# EAGLE design Lapse controller, Rev2 (EAGLE 7.2.0)
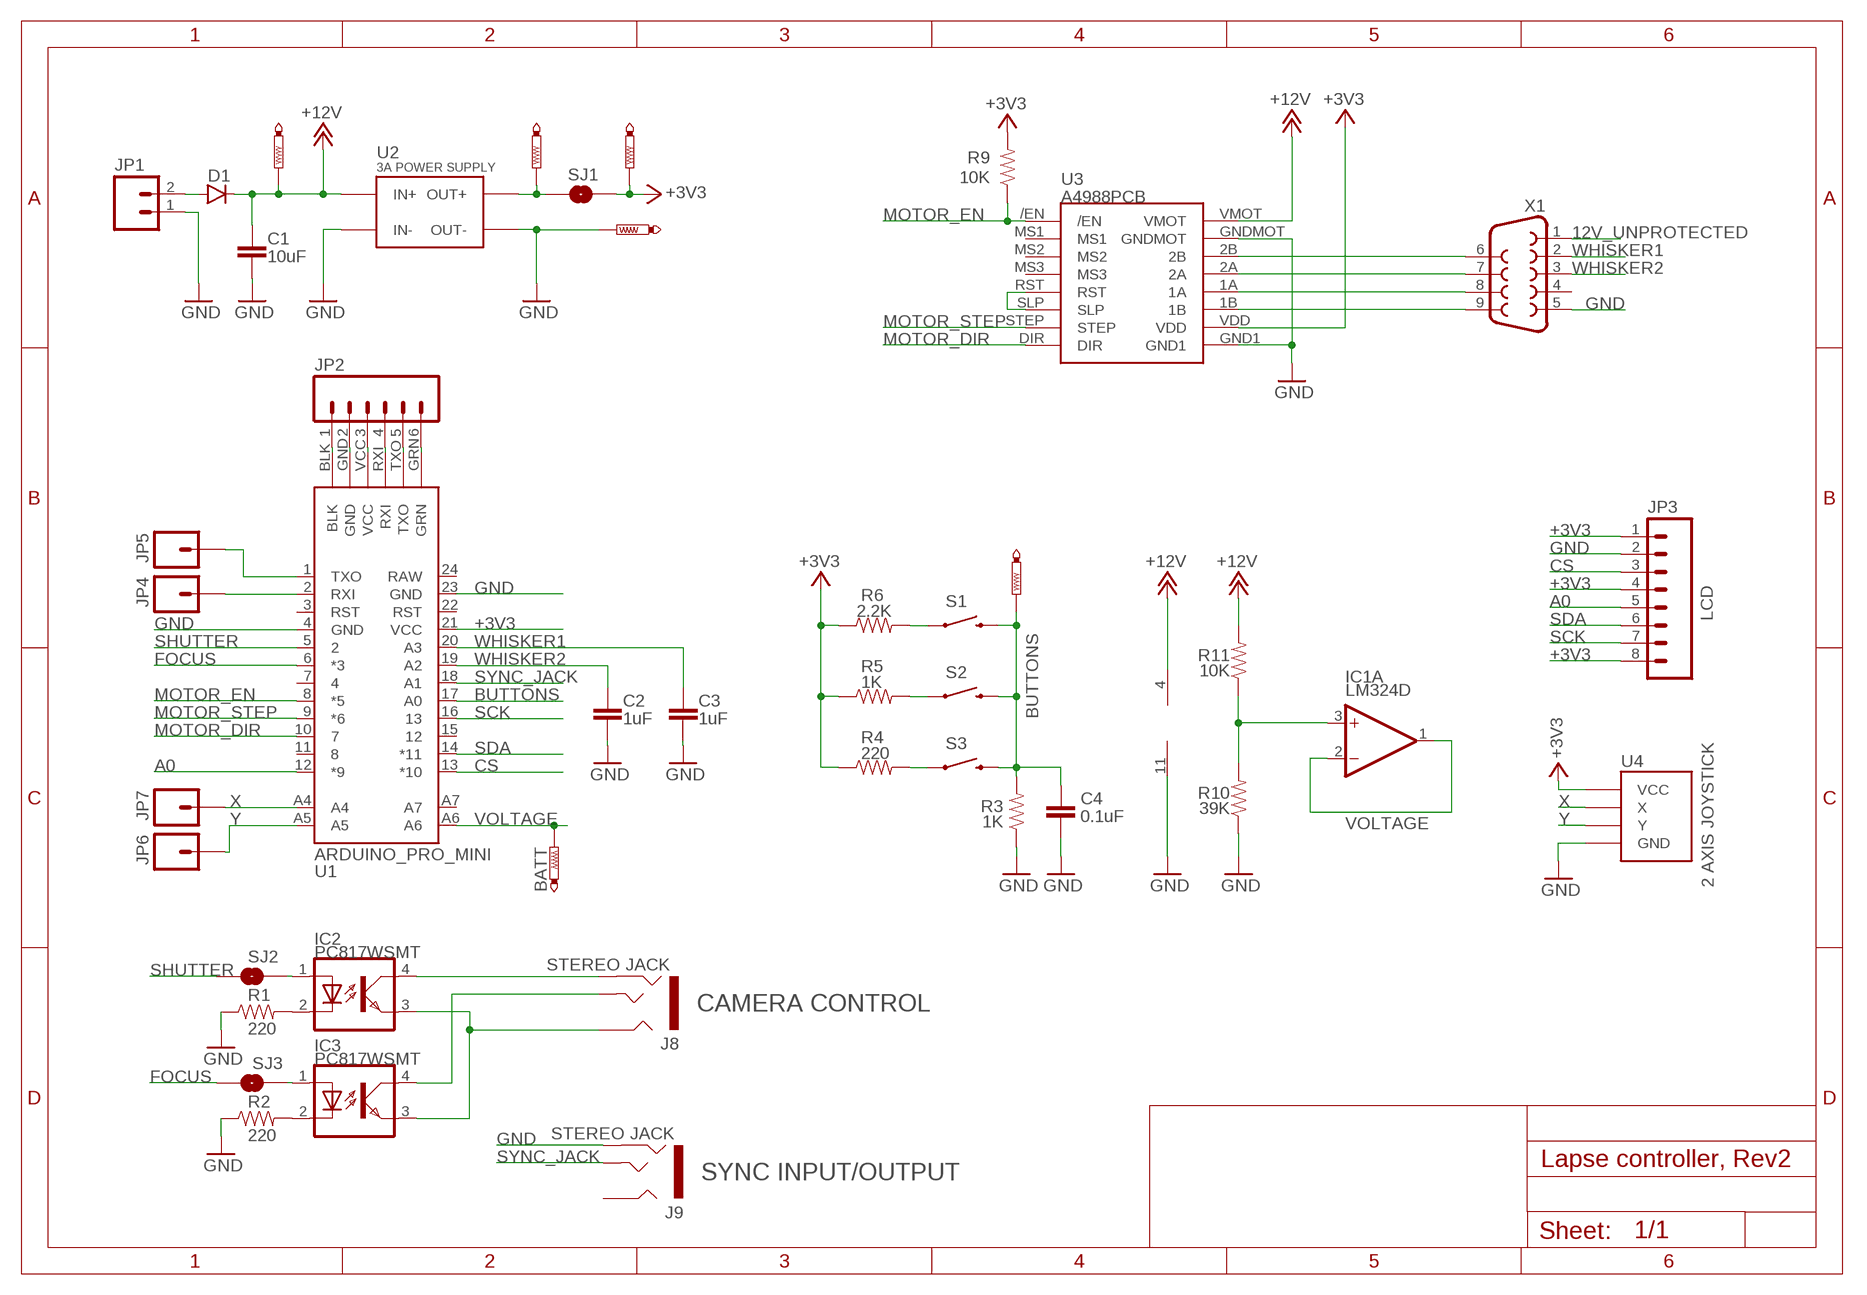
[diagram p0: schematic, sheet 1]

## Parts
3.3V  PTR1PAD1-13  [P1-13]
3.3V1  PTR1PAD1-13  [P1-13]
12V  PTR1PAD1-13  [P1-13]
BATT  PTR1PAD1-13  [P1-13]
BUTTON  PTR1PAD1-13  [P1-13]
C1  10uF  C-EUC0805K  [C0805K]
C2  1uF  C-EUC0805K  [C0805K]
C3  1uF  C-EUC0805K  [C0805K]
C4  0.1uF  C-EUC1206K  [C1206K]
D1  DIODESMA  [SMA-DIODE]
GND  PTR1PAD1-13  [P1-13]
IC1  LM324D  [SO14]
IC2  PC817WSMT  [WSMT]
IC3  PC817WSMT  [WSMT]
J8  STEREO JACK  AUDIO-JACK3  [AUDIO-JACK-TRRS-SMD]
J9  STEREO JACK  AUDIO-JACK3  [AUDIO-JACK-TRRS-SMD]
JP1  M02PTH3  [1X02_LONGPADS]
JP2  M06NO_SILK_FEMALE_PTH  [1X06_NO_SILK]
JP3  LCD  M08LONGPADS  [1X08_LONGPADS]
JP4  M01OFFSET  [1X01_OFFSET]
JP5  M01OFFSET  [1X01_OFFSET]
JP6  M01OFFSET  [1X01_OFFSET]
JP7  M01OFFSET  [1X01_OFFSET]
R1  220  RESISTOR1206  [1206]
R2  220  RESISTOR1206  [1206]
R3  1K  RESISTOR1206  [1206]
R4  220  RESISTOR1206  [1206]
R5  1K  RESISTOR1206  [1206]
R6  2.2K  RESISTOR1206  [1206]
R9  10K  RESISTOR1206  [1206]
R10  39K  RESISTOR1206  [1206]
R11  10K  RESISTOR1206  [1206]
S1  SWITCH-MOMENTARY-212MM  [TACTILE-PTH-12MM]
S2  SWITCH-MOMENTARY-212MM  [TACTILE-PTH-12MM]
S3  SWITCH-MOMENTARY-212MM  [TACTILE-PTH-12MM]
SJ1  JUMPER-PAD-2-NOROUND  [PAD-JUMPER-2-NO_YES_SILK_ROUND]
SJ2  JUMPER-PAD-2-NO  [PAD-JUMPER-2-NO_NO_SILK]
SJ3  JUMPER-PAD-2-NO  [PAD-JUMPER-2-NO_NO_SILK]
U1  ARDUINO_PRO_MINI  [ARDUINO_PRO_MINI]
U2  3A POWER SUPPLY  3A_DC_DC_SUPERMINI_PWR_SUPPLY  [3A_DC_DC_SUPERMINI_PWR_SUPPLY]
U3  A4988PCB  [A4988PCB]
U4  2 AXIS JOYSTICK  2WAY_JOYSTICK  [2WAY_JOYSTICK]
X1  CONN  F09D  [F09D]

## Nets
12V_UNPROTECTED: D1.A JP1.2 X1.1
+3V3: 3.3V.TP JP3.1 JP3.4 JP3.8 R4.1 R5.1 R6.1 R9.2 SJ1.2 U1.21(VCC) U3.VDD U4.P$1(VCC) U4.P$4(VCC)
+12V: 12V.TP C1.1 D1.C IC1.4(P:V+) R11.2 U2.IN+ U3.VMOT
A0: JP3.5 U1.12(*9)
BUTTONS: BUTTON.TP C4.1 R3.2 S1.3 S2.3 S3.3 U1.17(A0)
CS: JP3.3 U1.13(*10)
FOCUS: SJ3.1 U1.6(*3)
FOCUS_A: IC3.1(A) SJ3.2
GND: C1.2 C2.2 C3.2 C4.2 GND.TP IC1.11(P:V-) J9.RING2A(RING2) J9.RING2B(RING2) JP1.1 JP3.2 R1.1 R2.1 R3.1 R10.1 U1.4(GND) U1.23(GND) U2.IN- U2.OUT- U3.GND1 U3.GNDMOT U4.P$3(GND) U4.P$6(GND) X1.5
MOTOR_DIR: U1.10 U3.DIR
MOTOR_EN: R9.1 U1.8(*5) U3./EN
MOTOR_STEP: U1.9(*6) U3.STEP
N$1: 3.3V1.TP SJ1.1 U2.OUT+
N$2: IC2.2(C) R1.2
N$3: IC3.2(C) R2.2
N$4: IC2.4(COL) J8.RING2A(RING2) J8.RING2B(RING2)
N$5: IC2.3(EMIT) IC3.3(EMIT) J8.RING1A(RING1) J8.RING1B(RING1)
N$6: IC3.4(COL) J8.EARTH1(TIP) J8.EARTH2(TIP)
N$7: R4.2 S3.1
N$8: R5.2 S2.1
N$9: R6.2 S1.1
N$10: U3.RST U3.SLP
N$11: U3.2B X1.6
N$12: U3.2A X1.7
N$13: U3.1A X1.8
N$14: U3.1B X1.9
N$15: JP2.1 U1.BLK
N$16: IC1.3(A:+IN) R10.2 R11.1
N$17: JP2.2 U1.GND
N$18: JP2.3 U1.VCC
N$19: JP2.4 U1.RXI
N$20: JP2.5 U1.TXO
N$21: JP2.6 U1.GRN
N$22: JP4.1 U1.2(RXI)
N$23: JP5.1 U1.1(TXO)
SCK: JP3.7 U1.16
SDA: JP3.6 U1.14(*11)
SHUTTER: SJ2.1 U1.5
SHUTTER_A: IC2.1(A) SJ2.2
SYNC_JACK: J9.EARTH1(TIP) J9.EARTH2(TIP) U1.18(A1)
VOLTAGE: BATT.TP IC1.1(A:OUT) IC1.2(A:-IN) U1.A6
WHISKER1: C3.1 U1.20(A3) X1.2
WHISKER2: C2.1 U1.19(A2) X1.3
X: JP7.1 U1.A4 U4.P$2(X)
Y: JP6.1 U1.A5 U4.P$5(Y)
Unconnected: IC1.5(B:+IN) IC1.6(B:-IN) IC1.7(B:OUT) IC1.8(C:OUT) IC1.9(C:-IN) IC1.10(C:+IN) IC1.12(D:+IN) IC1.13(D:-IN) IC1.14(D:OUT) J9.RING1A(RING1) J9.RING1B(RING1) U1.3(RST) U1.7 U1.11 U1.15 U1.22(RST) U1.24(RAW) U1.A7 U3.MS1 U3.MS2 U3.MS3 X1.4

## Notes on the sheet
- CAMERA CONTROL
- SYNC INPUT/OUTPUT

## Library data of the parts
3.3V 3.3V1 12V BATT BUTTON GND = testpad:PTR1: TEST PIN
C1-C4 = rcl:C-EU: CAPACITOR, European symbol
D1 = SparkFun-DiscreteSemi:DIODE: Diode These are standard reverse protection diodes and small signal diodes. SMA package can handle up to about 1A. SOD-323 can handle about 200mA. What the SOD-323 package when ordering, there are some mfgs out there that are 5-pin packages.
IC1 = linear:LM324: OP AMP
IC2 IC3 = bymacf:PC817: SHARP OPTO COUPLER
J8 J9 = bymacf:AUDIO-JACK3: Audio jack - 3.5mm three rings SMD
JP1 = SparkFun-Connectors:M02: Standard 2-pin 0.1" header. Use with - straight break away headers ( PRT-00116) - right angle break away headers (PRT-00553) - swiss pins (PRT-00743) - machine pins (PRT-00117) - female headers (PRT-00115) Molex polarized connector foot print use with: PRT-08233 with associated crimp pins and housings. 2.54_SCREWTERM for use with PRT-10571. 3.5mm Screw Terminal footprints for PRT-08084 5mm Screw Terminal footprints for use with PRT-08432
JP2 = SparkFun-Connectors:M06: Header 6 Standard 6-pin 0.1" header. Use with straight break away headers (SKU : PRT-00116), right angle break away headers (PRT-00553), swiss pins (PRT-00743), machine pins (PRT-00117), and female headers (PRT-00115). Molex polarized connector foot print use with SKU : PRT-08094 with associated crimp pins and housings. NOTES ON THE VARIANTS LOCK and LOCK_LONGPADS... This footprint was designed to help hold the alignment of a through-hole component (i.e. 6-pin header) while soldering it into place. You may notice that each hole has been shifted either up or down by 0.005 of an inch from it's more standard position (which is a perfectly straight line). This slight alteration caused the pins (the squares in the middle) to touch the edges of the holes. Because they are alternating, it causes a "brace" to hold the component in place. 0.005 has proven to be the perfect amount of "off-center" position when using our standard breakaway headers. Although looks a little odd when you look at the bare footprint, once you have a header in there, the alteration is very hard to notice. Also,if you push a header all the way into place, it is covered up entirely on the bottom side. This idea of altering the position of holes to aid alignment will be further integrated into the Sparkfun Library for other footprints. It can help hold any component with 3 or more connection pins.; PROD_ID: CONN-08437
JP3 = SparkFun-Connectors:M08: Header 8 Standard 8-pin 0.1" header. Use with straight break away headers (SKU : PRT-00116), right angle break away headers (PRT-00553), swiss pins (PRT-00743), machine pins (PRT-00117), and female headers (PRT-00115).
JP4-JP7 = SparkFun-Connectors:M01: Header 1 Standard 1-pin 0.1" header. Use with straight break away headers (SKU : PRT-00116), right angle break away headers (PRT-00553), swiss pins (PRT-00743), machine pins (PRT-00117), and female headers (PRT-00115).
R1-R6 R9-R11 = SparkFun-Passives:RESISTOR: Resistor Basic schematic elements and footprints for 0603, 1206, and PTH resistors.
S1-S3 = SparkFun-Electromechanical:SWITCH-MOMENTARY-2: Various NO switches- pushbuttons, reed, etc; PROD_ID: SWCH-09185
SJ1-SJ3 = SparkFun-Passives:JUMPER-PAD-2-NO
U1 = bymacf:ARDUINO_PRO_MINI
U2 = bymacf:3A_DC_DC_SUPERMINI_PWR_SUPPLY: 100% brand new and high quality. Module Properties: Non-isolated step-down module (BUCK) Rectification: Synchronous rectification Input voltage: DC 4.75V-23V Output voltage: DC 1.0V-17V (Adjustable, Output < Input) Output current: Rated current 1.8A (3A MAX, can not be prolonged) Conversion efficiency:96%(highest) Switching Frequency: 340KHz. Output ripple:30mV(no-load) Load regulation:±0.5% Voltage regulation:±2.5% Operating Temperature: Industrial (-40℃ ~ +85℃) Short circuit protection: No(Please do not short-circuit) Input Reverse protection: No(Can not be reversed) Dimension: approx.17mm*11mm*3.8mm(L*W*H)/17*11*3.8 Supper mini board
U3 = bymacf:A4988PCB: A4988 PCB, Motor driver The A4988 is a complete microstepping motor driver with built-in translator for easy operation. It is designed to operate bipolar stepper motors in full-, half-, quarter-, eighth-, and sixteenth-step modes, with an output drive capacity of up to 35 V and ±2 A. The A4988 includes a fixed off-time current regulator which has the ability to operate in Slow or Mixed decay modes.
U4 = bymacf:2WAY_JOYSTICK
X1 = con-subd:F09: SUB-D; OC_FARNELL: unknown; OC_NEWARK: unknown

## Board
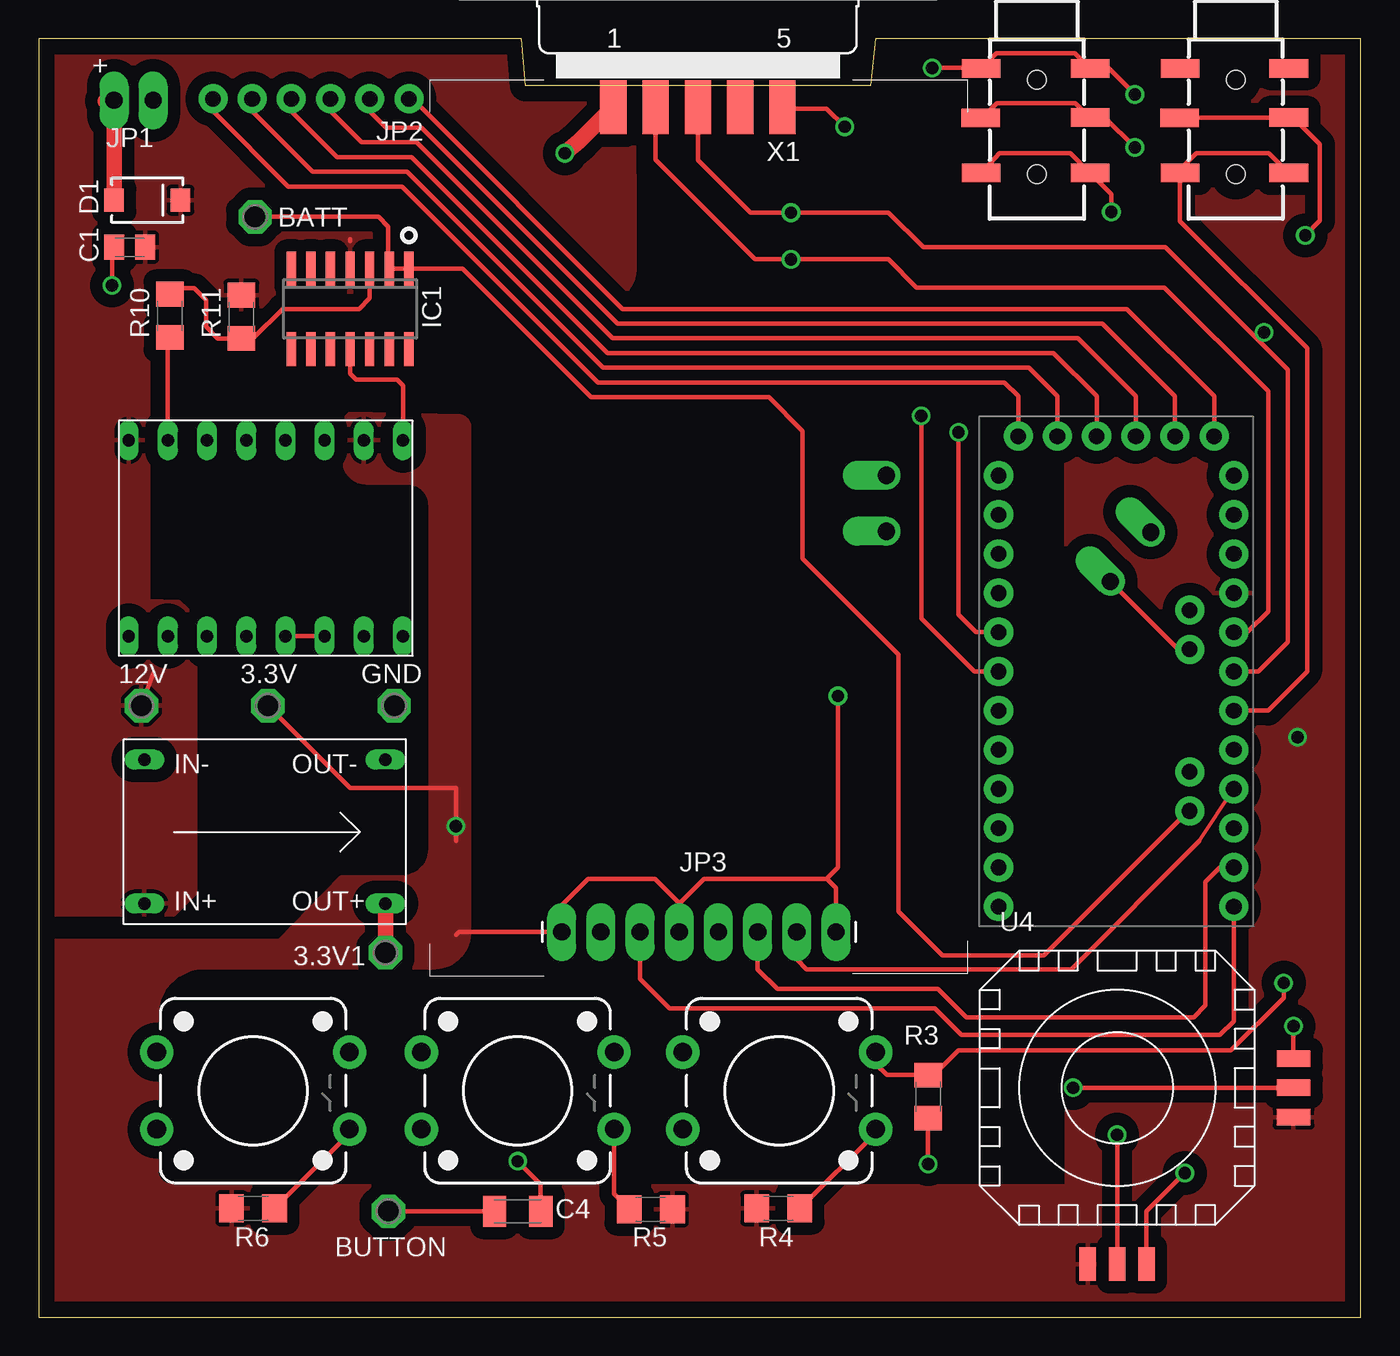
[diagram p1: board, top side]
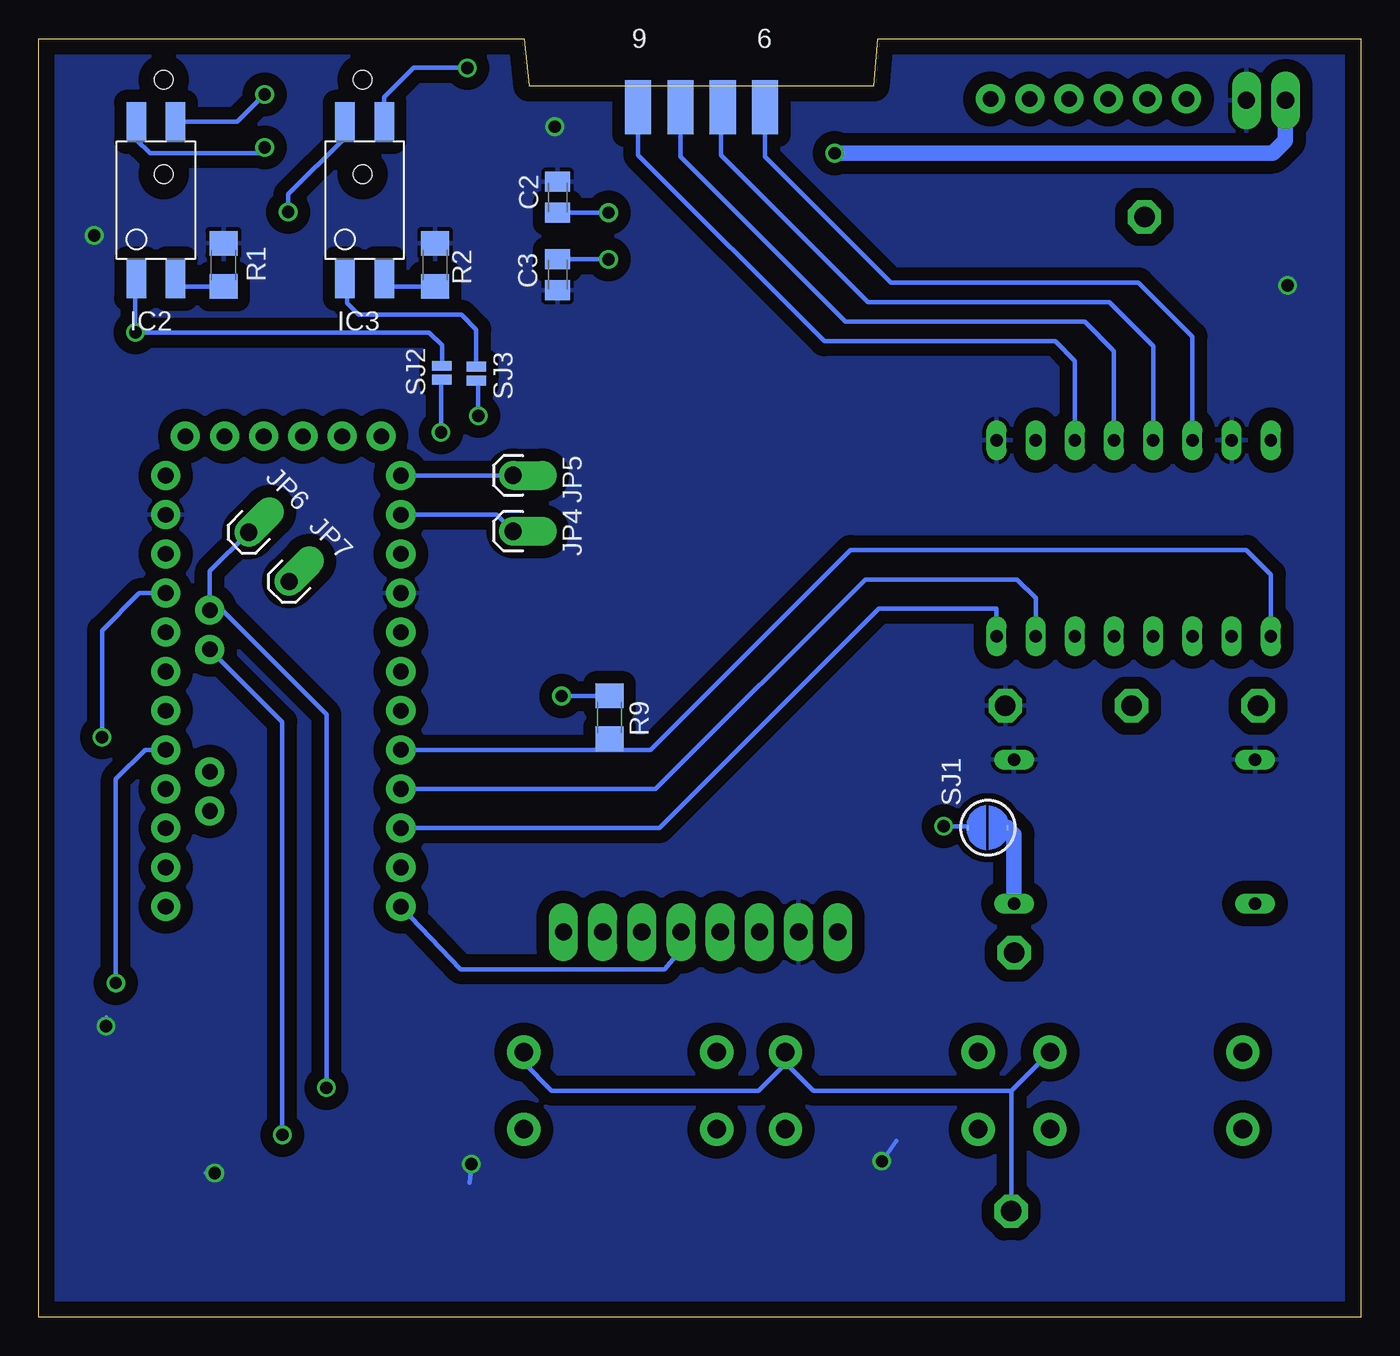
[diagram p2: board, bottom side, seen from below]

Size 85.71 x 82.87 mm. Coordinates in mm from the lower left corner, seen from the top.
Outline: 0,0 85.71,0 85.71,82.86 54.23,82.87 53.91,79.82 31.56,79.82 31.31,82.86 0,82.86 0,0
Copper layers (1*16): Top 0.035mm / dielectric 1.5mm / Bottom 0.035mm
Design rules "default": minimum track width 10mil, minimum drill 24mil, track to track 8mil, track to pad 8mil, pad to pad 8mil, via to via 8mil, smd to smd 8mil, copper to edge 40mil, drill to drill 8mil, minimum pad ring 10mil, minimum via ring 8mil, stop-mask expansion 4mil, vias tented up to drill 0mil, thermal gap 10mil

### Footprints (pad centres in the part's own frame; a part is rotated, then mirrored left to right if it is on the bottom)
P1-13 = drill 1.321 pad 2.159 octagon: TP 0,0
C0805K = smd 1.3 x 1.6: 1 -1,0; 2 1,0
C1206K = smd 1.5 x 2: 1 -1.5,0; 2 1.5,0
SMA-DIODE = smd 1.27 x 1.47: A -2.15,0; C 2.15,0
SO14 = smd 0.6 x 2.2: 1 -3.81,-2.6; 2 -2.54,-2.6; 3 -1.27,-2.6; 4 0,-2.6; 5 1.27,-2.6; 6 2.54,-2.6; 7 3.81,-2.6; 8 3.81,2.6; 9 2.54,2.6; 10 1.27,2.6; 11 0,2.6; 12 -1.27,2.6; 13 -2.54,2.6; 14 -3.81,2.6
WSMT = smd 2.54 x 1.27: 1 -5.08,1.27; 2 -5.08,-1.27; 3 5.08,-1.27; 4 5.08,1.27
AUDIO-JACK-TRRS-SMD = smd 1.2 x 2.5: EARTH1 9.995,3.441; EARTH2 9.995,-3.608; RING1A 3.2,3.441; RING1B 3.2,-3.608; RING2A 6.391,3.441; RING2B 6.41,-3.631 | hole 1.2: 3.95,0; 10.06,0
1X02_LONGPADS = drill 1.118 pad 1.88 long: 1 0,0; 2 2.54,0
1X06_NO_SILK = drill 1.016 pad 1.88: 1 0,0; 2 2.54,0; 3 5.08,0; 4 7.62,0; 5 10.16,0; 6 12.7,0
1X08_LONGPADS = drill 1.118 pad 1.88 long: 1 0,0; 2 2.54,0; 3 5.08,0; 4 7.62,0; 5 10.16,0; 6 12.7,0; 7 15.24,0; 8 17.78,0
1X01_OFFSET = drill 1.118 pad 1.88 offset: 1 0,0
1206 = smd 1.6 x 1.8: 1 -1.4,0; 2 1.4,0
TACTILE-PTH-12MM = drill 1.2 pad 2.159: 1 6.25,-2.5; 2 -6.25,-2.5; 3 6.25,2.5; 4 -6.25,2.5
PAD-JUMPER-2-NO_YES_SILK_ROUND = smd 0.152 x 0.305: 1 -1.27,0; 2 1.27,0
PAD-JUMPER-2-NO_NO_SILK = smd 0.635 x 1.27: 1 -0.45,0; 2 0.45,0
ARDUINO_PRO_MINI = drill 1.016 pad 1.88: 1 -7.62,12.7; 2 -7.62,10.16; 3 -7.62,7.62; 4 -7.62,5.08; 5 -7.62,2.54; 6 -7.62,0; 7 -7.62,-2.54; 8 -7.62,-5.08; 9 -7.62,-7.62; 10 -7.62,-10.16; 11 -7.62,-12.7; 12 -7.62,-15.24; 13 7.62,-15.24; 14 7.62,-12.7; 15 7.62,-10.16; 16 7.62,-7.62; 17 7.62,-5.08; 18 7.62,-2.54; 19 7.62,0; 20 7.62,2.54; 21 7.62,5.08; 22 7.62,7.62; 23 7.62,10.16; 24 7.62,12.7; A4 4.763,1.429; A5 4.763,3.969; A6 4.763,-9.049; A7 4.763,-6.509; BLK -6.35,15.24; GND -3.81,15.24; GRN 6.35,15.24; RXI 1.27,15.24; TXO 3.81,15.24; VCC -1.27,15.24
3A_DC_DC_SUPERMINI_PWR_SUPPLY = drill 0.8 long: IN+ -7.62,-4.636; IN- -7.62,4.699; OUT+ 8.001,-4.636; OUT- 8.001,4.699
A4988PCB = drill 0.8 long: 1A 6.35,-1.27; 1B 6.35,-3.81; 2A 6.35,1.27; 2B 6.35,3.81; /EN -6.35,8.89; DIR -6.35,-8.89; GND1 6.35,-8.89; GNDMOT 6.35,6.35; MS1 -6.35,6.35; MS2 -6.35,3.81; MS3 -6.35,1.27; RST -6.35,-1.27; SLP -6.35,-3.81; STEP -6.35,-6.35; VDD 6.35,-6.35; VMOT 6.35,8.89
2WAY_JOYSTICK = smd 1.067 x 2.184: P$1 -1.905,-11.43; P$2 0,-11.43; P$3 1.905,-11.43 | smd 2.184 x 1.067: P$4 11.43,-1.905; P$5 11.43,0; P$6 11.43,1.905
F09D = smd 1.7 x 3.5: 1 -5.486,-6.045; 2 -2.743,-6.045; 3 0,-6.045; 4 2.743,-6.045; 5 5.486,-6.045 | smd 1.7 x 3.5 bottom: 6 -4.115,-6.045; 7 -1.372,-6.045; 8 1.372,-6.045; 9 4.115,-6.045

### Placement (x,y rotation side)
3.3V  14.86,39.62 270 top
3.3V1  22.48,23.62 0 top
12V  6.67,39.62 270 top
BATT  14.03,71.31 0 top
BUTTON  22.67,6.86 0 top
C1  5.91,69.34 180 top
C2  52.07,72.58 90 bottom
C3  52.07,67.56 270 bottom
C4  31.05,6.86 0 top
D1  7.05,72.39 0 top
GND  23.05,39.62 270 top
IC1  20.19,65.34 180 top
IC2  78.11,72.39 90 bottom
IC3  64.58,72.39 90 bottom
J8  64.71,84.14 270 top
J9  77.6,84.14 270 top
JP1  7.43,78.87 180 top
JP2  11.3,78.95 0 top
JP3  33.91,24.96 0 top
JP4  54.96,50.94 270 bottom
JP5  54.95,54.56 270 bottom
JP6  72.09,50.86 315 bottom
JP7  69.48,47.68 315 bottom
R1  73.72,68.2 270 bottom
R2  60.01,68.2 270 bottom
R3  57.66,14.29 90 top
R4  47.94,7.05 0 top
R5  39.69,6.98 180 top
R6  13.91,7.05 0 top
R9  48.7,38.86 90 bottom
R10  8.51,64.9 90 top
R11  13.14,64.83 90 top
S1  13.91,14.67 0 top
S2  31.05,14.67 0 top
S3  48.01,14.67 0 top
SJ1  24.19,31.72 180 bottom
SJ2  59.57,61.21 90 bottom
SJ3  57.34,61.15 90 bottom
U1  69.85,41.85 0 top
U2  14.48,31.43 0 top
U3  14.73,50.48 90 top
U4  69.91,14.86 0 top
X1  42.74,84.45 0 top

### Tracks (layer width: path | path; a pad name or v marks a point on that pad's centre or on a via)
12V_UNPROTECTED  (via drill 0.8)
  Top 1.016: v34.1,75.44 35.04,76.2 X1.1 | 4.33,78.81 JP1.2 4.89,72.57 D1.A
  Bottom 1.016: v34.1,75.44 5.71,75.44 4.89,76.26 JP1.2
+3V3  (via drill 0.8)
  Top 0.305: JP3.8 51.69,27.81 51.12,28.38 51.06,28.38 | 41.53,26.8 39.94,28.38 35.62,28.38 33.91,26.67 JP3.1 27.24,24.95 27.05,24.76 | JP3.4 41.53,26.8 | 41.53,26.8 43.12,28.38 51.06,28.38 | v51.82,40.26 51.82,29.15 51.06,28.38 | 27.05,30.86 v27.05,31.81 27.05,34.29 20.19,34.29 3.3V.TP
  Bottom 0.305: v81.6,37.59 81.6,44.51 79.19,46.93 U1.21 | v51.82,40.26 49.85,40.26 R9.2 | SJ1.2 25.56,31.81 v27.05,31.81
  pour Top (isolate 0.813): 20.19,58.55 19.81,58.17 19.81,55.53 arc90 21.24,54.1 23.91,54.1 arc-90 25.4,52.61 25.4,30.45 arc-90 23.62,28.48 19.62,28.48 15.62,24.38 0.19,24.38 0.2,24.29 0.15,-0.04 85.56,-0.04 85.56,82.71 66.61,82.71 66.64,8.51 8.67,8.48 arc-90 7.62,9.53 7.62,19.53 arc-90 10.76,22.67 25.72,22.67 arc90 27.91,25.05 27.91,57.53 arc90 27.24,58.39
+12V
  Top 0.305: 20.19,69.72 20.19,69.85 | 13.22,66.69 R11.2 | 12V.TP 7.43,41.72
  pour Top (isolate 0.813): 0.06,82.61 0.01,26.1 8.76,26.1 10.16,27.5 10.16,45.34 9.08,46.36 7.11,46.42 7.11,65.34 35.34,65.34 arc90 38.64,67.88 38.64,71.47 38.57,81.98 38.61,82.71
A0
  Bottom 0.305: JP3.5 44.07,23.81 45.15,22.54 58.36,22.54 U1.12
BUTTONS  (via drill 0.8)
  Top 0.305: S3.3 54.26,16.42 54.29,16.38 54.98,15.69 R3.2 58.04,15.68 59.63,17.27 77.28,17.27 80.71,20.7 v80.71,21.65 | C4.1 BUTTON.TP
  Bottom 0.305: 22.66,14.67 35.5,14.67 37.3,16.47 S2.3 37.3,16.42 39.05,14.67 52.45,14.67 54.26,16.47 S3.3 | v80.71,21.65 80.71,34.86 78.8,36.77 U1.17 | 22.66,14.67 S1.3 | 22.66,14.67 BUTTON.TP
CS
  Top 0.305: JP3.3 38.99,21.91 40.89,20 58.1,20 59.82,18.29 76.58,18.29 77.47,19.18 U1.13
FOCUS  (via drill 0.8)
  Top 0.305: v57.21,58.42 57.21,45.27 60.64,41.85 U1.6
  Bottom 0.305: v57.21,58.42 57.21,60.7 SJ3.1
FOCUS_A
  Bottom 0.305: SJ3.2 57.34,64.01 58.29,64.96 64.96,64.96 65.72,65.72 65.72,67.18 IC3.1
GND  (via drill 0.8)
  Top 0.305: J9.RING2A 80.7,77.73 J9.RING2B 79.06,77.72 81.34,77.72 83.06,76.01 83.06,71.06 v82.11,70.1 | v52.26,77.15 51.08,78.33 48.22,78.33 X1.5 | IC1.11 20.19,61.15 20.57,60.77 23.24,60.77 23.62,60.39 U3.GND1 | U3.GNDMOT 8.38,63.88 R10.1 | C1.2 4.76,69.15 v4.76,66.87 | R3.1 v57.66,9.91 | v74.3,9.33 71.82,6.86 U4.P$3 | U4.P$6 v81.34,18.86 | C4.2 32.55,8.6 v31.05,10.1
  Bottom 0.305: v57.66,9.91 57.78,8.7 | v31.05,10.1 30.1,11.43 | v74.3,9.33 74.87,9.33 | v81.34,18.86 81.34,19.43
  pour Bottom (isolate 0.813): 0.15,82.7 85.56,82.7 85.56,-0.04 0.15,0.15
MOTOR_DIR
  Bottom 0.305: U3.DIR 23.62,45.91 31.24,45.91 45.47,31.69 U1.10
MOTOR_EN
  Bottom 0.305: 48.51,36.77 U1.8 | U3./EN 5.84,48.13 7.43,49.72 33.08,49.72 46.04,36.77 48.51,36.77 | 48.51,36.77 R9.1
MOTOR_STEP
  Bottom 0.305: U1.9 45.72,34.23 32.13,47.82 22.29,47.82 21.08,46.61 U3.STEP
N$1
  Top 1.016: 3.3V1.TP U2.OUT+
  Bottom 1.016: U2.OUT+ 22.48,31.27 SJ1.1
N$2
  Bottom 0.305: IC2.2 76.32,66.8 R1.2
N$3
  Bottom 0.305: R2.2 62.8,66.8 IC3.2
N$4  (via drill 0.8)
  Top 0.305: J8.RING2B 61.15,77.73 62.1,78.68 67.22,78.68 J8.RING2A 69.13,77.75 v71.06,75.82
  Bottom 0.305: v71.06,75.82 71.44,75.44 78.49,75.44 79.38,76.33 IC2.4
N$5  (via drill 0.8)
  Top 0.305: v57.91,80.96 61.71,80.96 J8.RING1B 62.08,81.92 67.17,81.92 J8.RING1A 69.37,80.94 v71.06,79.25
  Bottom 0.305: v57.91,80.96 61.4,80.96 63.31,79.06 IC3.3 | v71.06,79.25 72.83,77.47 IC2.3
N$6  (via drill 0.8)
  Top 0.305: 60.26,73.98 61.57,73.98 J8.EARTH2 62.29,75.44 66.86,75.44 68.15,74.16 J8.EARTH1 68.19,74.14 68.2,74.16 | v69.53,71.63 69.53,72.77 69.1,73.2 68.2,74.16 | 68.2,74.16 67.58,74.16
  Bottom 0.305: IC3.4 65.85,76.45 69.53,72.77 v69.53,71.63
N$7
  Top 0.305: S3.1 54.26,11.9 R4.2
N$8
  Top 0.305: S2.1 37.3,7.97 R5.2
N$9
  Top 0.305: S1.1 20.16,11.9 R6.2
N$10
  Top 0.305: U3.SLP U3.RST
N$11
  Bottom 0.305: X1.6 38.62,75.2 30.48,67.06 14.41,67.06 10.92,63.56 U3.2B
N$12
  Bottom 0.305: X1.7 41.46,78.18 41.46,75.31 31.94,65.79 16.32,65.79 13.46,62.93 U3.2A
N$13
  Bottom 0.305: X1.8 44.11,75.22 33.4,64.52 17.91,64.52 16,62.61 U3.1A
N$14
  Bottom 0.305: X1.9 46.85,75.31 34.78,63.25 19.81,63.25 18.54,61.98 U3.1B
N$15
  Top 0.305: U1.BLK arc-90 U1.BLK 63.5,59.69 62.61,60.58 36.26,60.58 23.56,73.28 16.19,73.28 11.3,78.17 JP2.1
N$16
  Top 0.305: R10.2 8.51,66.67 10.1,66.67 10.86,65.91 10.86,64.2 11.62,63.43 R11.1 13.52,63.44 13.91,63.44 15.81,65.34 20.76,65.34 21.46,66.04 IC1.3
N$17
  Top 0.305: U1.GND arc-90 U1.GND 66.04,59.69 64.2,61.53 36.58,61.53 23.88,74.23 17.78,74.23 13.84,78.17 JP2.2
N$18
  Top 0.305: U1.VCC arc-90 U1.VCC 68.58,59.69 65.79,62.48 36.89,62.48 24.19,75.18 19.37,75.18 16.38,78.17 JP2.3
N$19
  Top 0.305: U1.RXI arc-90 U1.RXI 71.12,59.69 67.37,63.44 37.21,63.44 24.51,76.14 20.95,76.14 18.92,78.17 JP2.4
N$20
  Top 0.305: U1.TXO arc-90 U1.TXO 73.66,59.69 68.96,64.39 37.53,64.39 24.83,77.09 22.54,77.09 21.46,78.17 JP2.5
N$21
  Top 0.305: U1.GRN arc-90 U1.GRN 76.2,59.69 70.55,65.34 37.85,65.34 24.23,78.95 JP2.6
N$22
  Bottom 0.305: U1.2 56.02,52.01 JP4.1
N$23
  Bottom 0.305: U1.1 54.96,54.55 JP5.1
SCK
  Top 0.254: 75.25,30.86 U1.16
  Top 0.305: JP3.7 49.15,23.18 49.78,22.54 66.93,22.54 75.25,30.86
SDA
  Top 0.305: JP3.6 46.61,22.54 47.88,21.27 58.29,21.27 60.13,19.43 74.87,19.43 75.63,20.19 75.63,28.19 76.58,29.15 U1.14
SHUTTER  (via drill 0.8)
  Top 0.305: v59.63,57.34 59.63,45.53 60.77,44.39 U1.5
  Bottom 0.305: v59.63,57.34 59.63,60.76 SJ2.1
SHUTTER_A  (via drill 0.8)
  Bottom 0.305: IC2.1 79.44,67.25 v79.44,63.82 60.39,63.82 59.57,63 SJ2.2
SYNC_JACK
  Top 0.305: U1.18 79.69,39.31 82.23,41.85 82.23,62.8 73.99,71.05 J9.EARTH2 73.99,74.37 75.06,75.44 79.74,75.44 J9.EARTH1
VOLTAGE
  Top 0.305: IC1.1 IC1.2 22.67,68 22.67,70.67 22.03,71.31 BATT.TP | IC1.1 | IC1.1 27.5,67.94 35.81,59.63 47.34,59.63 49.53,57.44 49.53,49.15 55.72,42.96 55.72,26.29 58.58,23.43 65.15,23.43 74.52,32.8 U1.A6
WHISKER1  (via drill 0.8)
  Top 0.305: U1.20 78.36,44.39 79.69,45.72 79.69,60.01 72.96,66.74 56.9,66.74 55.07,68.56 v48.77,68.56 46.44,68.56 39.99,75.01 X1.2
  Bottom 0.305: C3.1 v48.77,68.56
WHISKER2  (via drill 0.8)
  Top 0.305: U1.19 79.06,41.85 80.96,43.75 80.96,61.4 73.03,69.34 57.34,69.34 55.1,71.58 v48.77,71.58 46.15,71.58 42.74,74.99 X1.3
  Bottom 0.305: C2.1 v48.77,71.58
X  (via drill 0.8)
  Top 0.305: U4.P$2 v69.91,11.81 | JP7.1 73.88,43.27 U1.A4
  Bottom 0.305: v69.91,11.81 69.91,38.58 U1.A4
Y  (via drill 0.8)
  Top 0.305: U4.P$5 v67.06,14.86
  Bottom 0.305: JP6.1 74.61,48.34 U1.A5 73.82,45.82 67.06,39.05 v67.06,14.86

### Text on the board
tPlace: +